# EAGLE design analog (EAGLE 8.3.0)

## Sheet 1 of 3
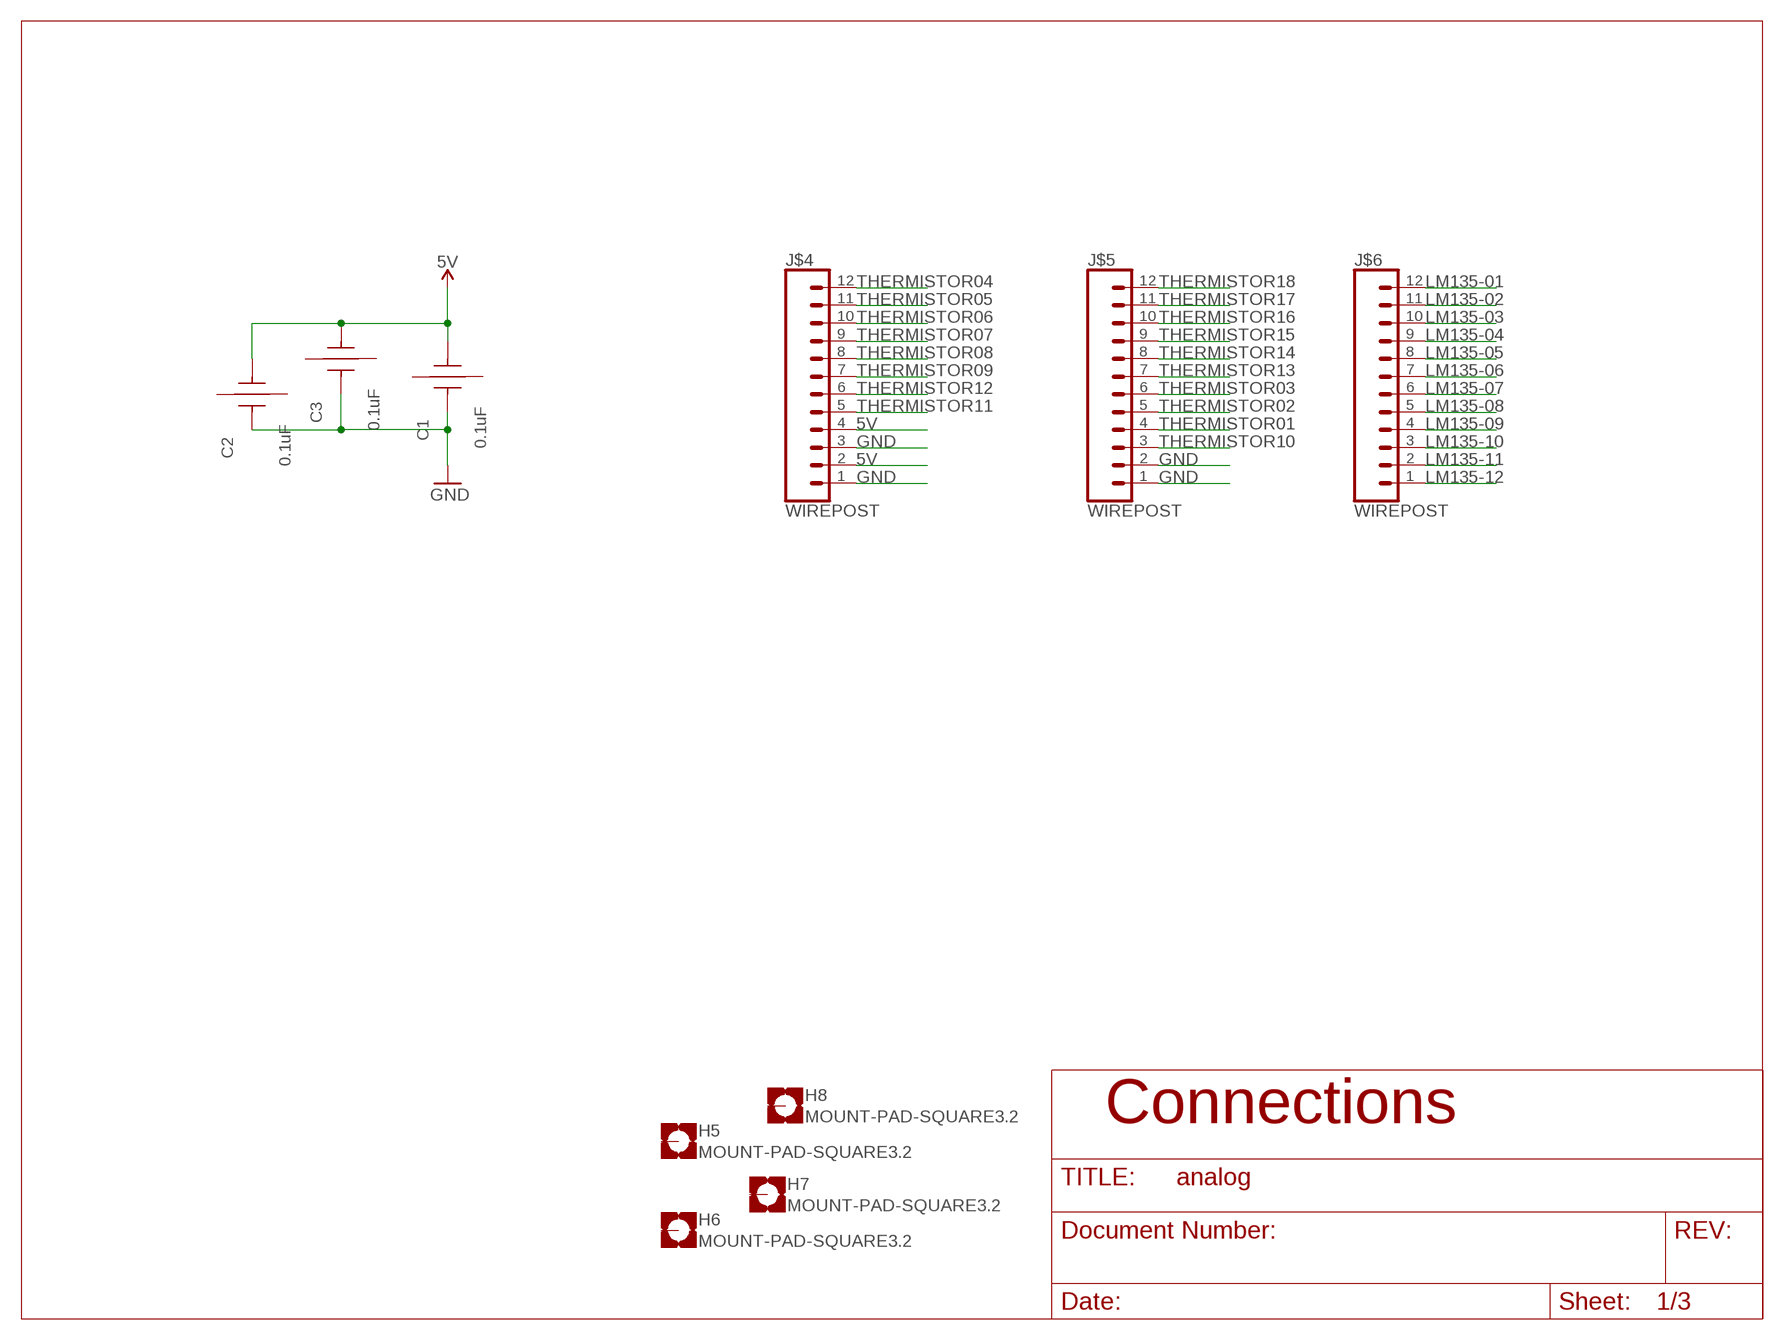
[diagram p0: schematic, sheet 1]

### Parts
C1  0.1uF  100X14W104MV4T  [X14]
C2  0.1uF  100X14W104MV4T  [X14]
C3  0.1uF  100X14W104MV4T  [X14]
H5  MOUNT-PAD-SQUARE3.2  [3,2-PAD-SQUARE]
H6  MOUNT-PAD-SQUARE3.2  [3,2-PAD-SQUARE]
H7  MOUNT-PAD-SQUARE3.2  [3,2-PAD-SQUARE]
H8  MOUNT-PAD-SQUARE3.2  [3,2-PAD-SQUARE]
J$4  WIREPOST  [WIREWRAPPOST]
J$5  WIREPOST  [WIREWRAPPOST]
J$6  WIREPOST  [WIREWRAPPOST]

### Nets
5V: C1.2 C2.2 C3.2 J$4.2 J$4.4 ; also sheet 2,3
GND [gnd]: C1.1 C2.1 C3.1 J$4.1 J$4.3 J$5.1 J$5.2 ; also sheet 2,3
LM135-01: J$6.12 ; also sheet 3
LM135-02: J$6.11 ; also sheet 3
LM135-03: J$6.10 ; also sheet 3
LM135-04: J$6.9 ; also sheet 3
LM135-05: J$6.8 ; also sheet 3
LM135-06: J$6.7 ; also sheet 3
LM135-07: J$6.6 ; also sheet 3
LM135-08: J$6.5 ; also sheet 3
LM135-09: J$6.4 ; also sheet 3
LM135-10: J$6.3 ; also sheet 3
LM135-11: J$6.2 ; also sheet 3
LM135-12: J$6.1 ; also sheet 3
THERMISTOR01: J$5.4 ; also sheet 2
THERMISTOR02: J$5.5 ; also sheet 2
THERMISTOR03: J$5.6 ; also sheet 2
THERMISTOR04: J$4.12 ; also sheet 2
THERMISTOR05: J$4.11 ; also sheet 2
THERMISTOR06: J$4.10 ; also sheet 2
THERMISTOR07: J$4.9 ; also sheet 2
THERMISTOR08: J$4.8 ; also sheet 2
THERMISTOR09: J$4.7 ; also sheet 2
THERMISTOR10: J$5.3 ; also sheet 2
THERMISTOR11: J$4.5 ; also sheet 2
THERMISTOR12: J$4.6 ; also sheet 2
THERMISTOR13: J$5.7 ; also sheet 2
THERMISTOR14: J$5.8 ; also sheet 2
THERMISTOR15: J$5.9 ; also sheet 2
THERMISTOR16: J$5.10 ; also sheet 2
THERMISTOR17: J$5.11 ; also sheet 2
THERMISTOR18 [gnd]: J$5.12 ; also sheet 2
Unconnected: C1.3 C1.4 C2.3 C2.4 C3.3 C3.4 H5.B3,2(MOUNT) H6.B3,2(MOUNT) H7.B3,2(MOUNT) H8.B3,2(MOUNT)

### Notes on the sheet
- Connections

## Sheet 2 of 3
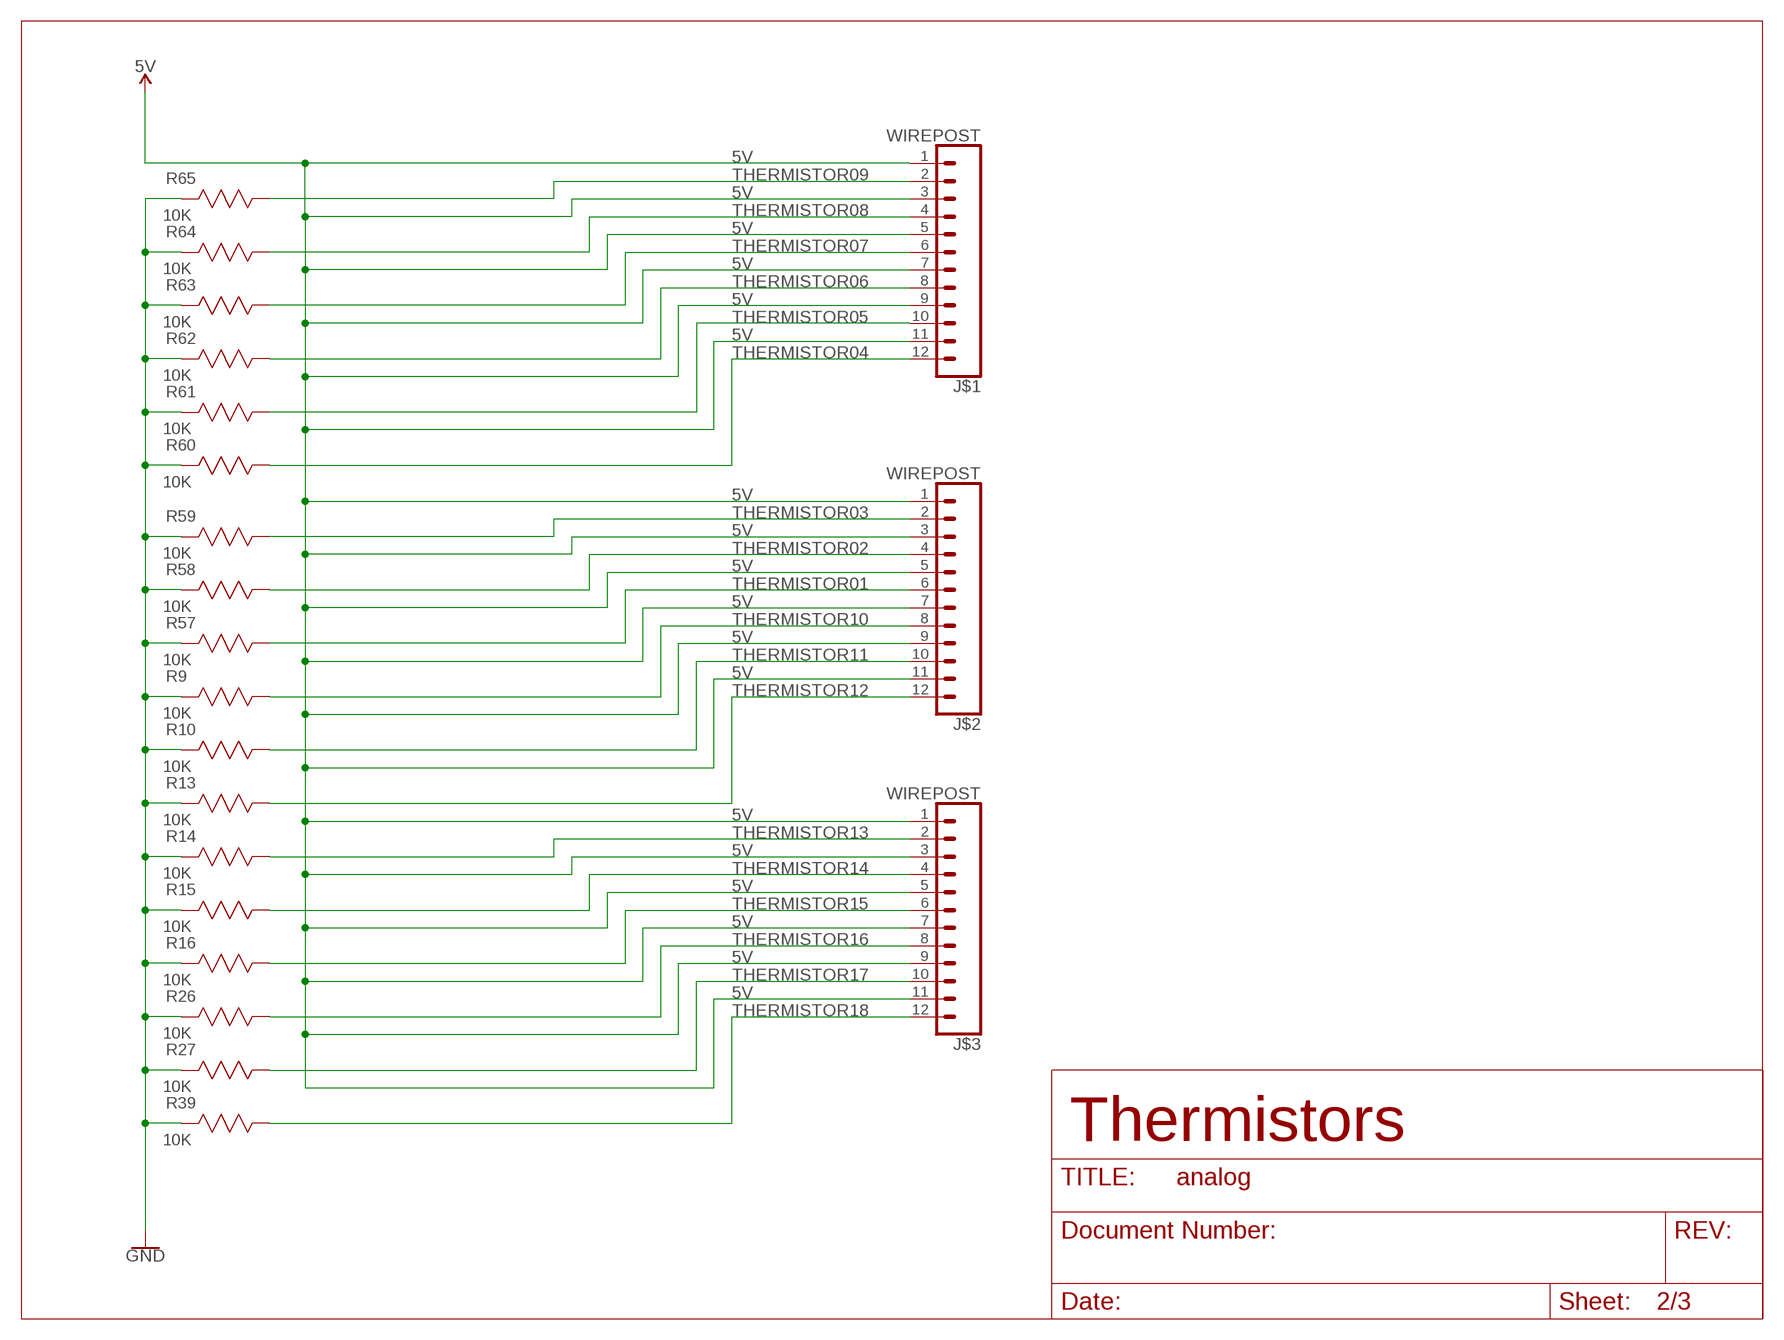
[diagram p1: schematic, sheet 2]

### Parts
J$1  WIREPOST  [WIREWRAPPOST]
J$2  WIREPOST  [WIREWRAPPOST]
J$3  WIREPOST  [WIREWRAPPOST]
R9  10K  RC0603JR-0710KL  [RC0603N]
R10  10K  RC0603JR-0710KL  [RC0603N]
R13  10K  RC0603JR-0710KL  [RC0603N]
R14  10K  RC0603JR-0710KL  [RC0603N]
R15  10K  RC0603JR-0710KL  [RC0603N]
R16  10K  RC0603JR-0710KL  [RC0603N]
R26  10K  RC0603JR-0710KL  [RC0603N]
R27  10K  RC0603JR-0710KL  [RC0603N]
R39  10K  RC0603JR-0710KL  [RC0603N]
R57  10K  RC0603JR-0710KL  [RC0603N]
R58  10K  RC0603JR-0710KL  [RC0603N]
R59  10K  RC0603JR-0710KL  [RC0603N]
R60  10K  RC0603JR-0710KL  [RC0603N]
R61  10K  RC0603JR-0710KL  [RC0603N]
R62  10K  RC0603JR-0710KL  [RC0603N]
R63  10K  RC0603JR-0710KL  [RC0603N]
R64  10K  RC0603JR-0710KL  [RC0603N]
R65  10K  RC0603JR-0710KL  [RC0603N]

### Nets
5V: J$1.1 J$1.3 J$1.5 J$1.7 J$1.9 J$1.11 J$2.1 J$2.3 J$2.5 J$2.7 J$2.9 J$2.11 J$3.1 J$3.3 J$3.5 J$3.7 J$3.9 J$3.11 ; also sheet 1,3
GND [gnd]: R9.2 R10.2 R13.2 R14.2 R15.2 R16.2 R26.2 R27.2 R39.2 R57.2 R58.2 R59.2 R60.2 R61.2 R62.2 R63.2 R64.2 R65.2 ; also sheet 1,3
THERMISTOR01: J$2.6 R57.1 ; also sheet 1
THERMISTOR02: J$2.4 R58.1 ; also sheet 1
THERMISTOR03: J$2.2 R59.1 ; also sheet 1
THERMISTOR04: J$1.12 R60.1 ; also sheet 1
THERMISTOR05: J$1.10 R61.1 ; also sheet 1
THERMISTOR06: J$1.8 R62.1 ; also sheet 1
THERMISTOR07: J$1.6 R63.1 ; also sheet 1
THERMISTOR08: J$1.4 R64.1 ; also sheet 1
THERMISTOR09: J$1.2 R65.1 ; also sheet 1
THERMISTOR10: J$2.8 R9.1 ; also sheet 1
THERMISTOR11: J$2.10 R10.1 ; also sheet 1
THERMISTOR12: J$2.12 R13.1 ; also sheet 1
THERMISTOR13: J$3.2 R14.1 ; also sheet 1
THERMISTOR14: J$3.4 R15.1 ; also sheet 1
THERMISTOR15: J$3.6 R16.1 ; also sheet 1
THERMISTOR16: J$3.8 R26.1 ; also sheet 1
THERMISTOR17: J$3.10 R27.1 ; also sheet 1
THERMISTOR18 [gnd]: J$3.12 R39.1 ; also sheet 1

### Notes on the sheet
- Thermistors

## Sheet 3 of 3
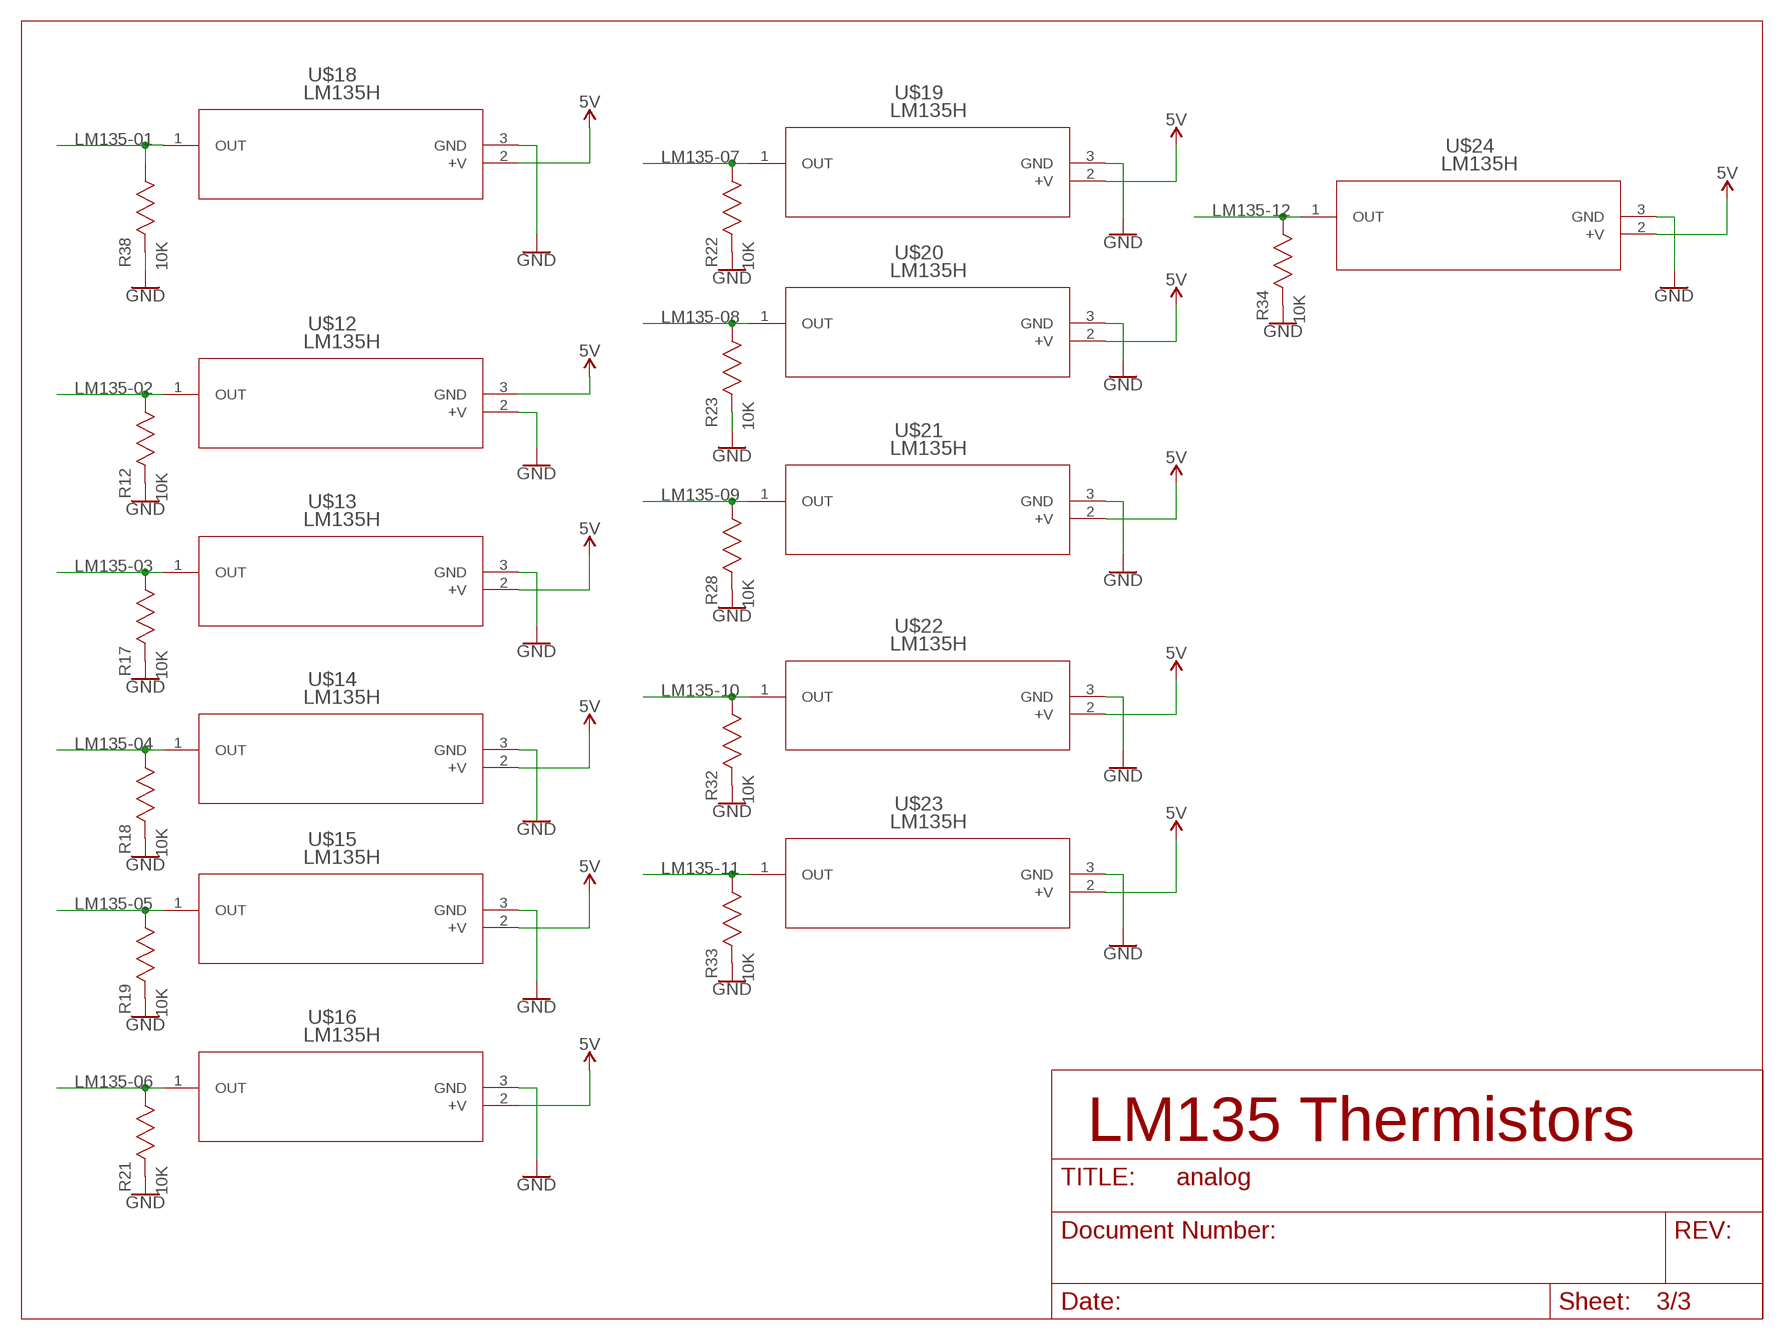
[diagram p2: schematic, sheet 3]

### Parts
R12  10K  RC0603JR-0710KL  [RC0603N]
R17  10K  RC0603JR-0710KL  [RC0603N]
R18  10K  RC0603JR-0710KL  [RC0603N]
R19  10K  RC0603JR-0710KL  [RC0603N]
R21  10K  RC0603JR-0710KL  [RC0603N]
R22  10K  RC0603JR-0710KL  [RC0603N]
R23  10K  RC0603JR-0710KL  [RC0603N]
R28  10K  RC0603JR-0710KL  [RC0603N]
R32  10K  RC0603JR-0710KL  [RC0603N]
R33  10K  RC0603JR-0710KL  [RC0603N]
R34  10K  RC0603JR-0710KL  [RC0603N]
R38  10K  RC0603JR-0710KL  [RC0603N]
U$12  LM135H  [TO46]
U$13  LM135H  [TO46]
U$14  LM135H  [TO46]
U$15  LM135H  [TO46]
U$16  LM135H  [TO46]
U$18  LM135H  [TO46]
U$19  LM135H  [TO46]
U$20  LM135H  [TO46]
U$21  LM135H  [TO46]
U$22  LM135H  [TO46]
U$23  LM135H  [TO46]
U$24  LM135H  [TO46]

### Nets
5V: U$12.3(GND) U$13.2(+V) U$14.2(+V) U$15.2(+V) U$16.2(+V) U$18.2(+V) U$19.2(+V) U$20.2(+V) U$21.2(+V) U$22.2(+V) U$23.2(+V) U$24.2(+V) ; also sheet 1,2
GND [gnd]: R12.2 R17.2 R18.2 R19.2 R21.2 R22.2 R23.2 R28.2 R32.2 R33.2 R34.2 R38.2 U$12.2(+V) U$13.3(GND) U$14.3(GND) U$15.3(GND) U$16.3(GND) U$18.3(GND) U$19.3(GND) U$20.3(GND) U$21.3(GND) U$22.3(GND) U$23.3(GND) U$24.3(GND) ; also sheet 1,2
LM135-01: R38.1 U$18.1(OUT) ; also sheet 1
LM135-02: R12.1 U$12.1(OUT) ; also sheet 1
LM135-03: R17.1 U$13.1(OUT) ; also sheet 1
LM135-04: R18.1 U$14.1(OUT) ; also sheet 1
LM135-05: R19.1 U$15.1(OUT) ; also sheet 1
LM135-06: R21.1 U$16.1(OUT) ; also sheet 1
LM135-07: R22.1 U$19.1(OUT) ; also sheet 1
LM135-08: R23.1 U$20.1(OUT) ; also sheet 1
LM135-09: R28.1 U$21.1(OUT) ; also sheet 1
LM135-10: R32.1 U$22.1(OUT) ; also sheet 1
LM135-11: R33.1 U$23.1(OUT) ; also sheet 1
LM135-12: R34.1 U$24.1(OUT) ; also sheet 1

### Notes on the sheet
- LM135 Thermistors

## Library data of the parts
C1-C3 = capacitor_01uf:100X14W104MV4T; MANUFACTURER_PART_NUMBER: 100X14W104MV4T; VENDOR: Johanson Technology
H5-H8 = holes:MOUNT-PAD-SQUARE: MOUNTING PAD, square
J$1-J$6 = cubesat:WIREPOST
R9 R10 R12-R19 R21-R23 R26-R28 R32-R34 R38 R39 R57-R65 = cubesat_r10K:RC0603JR-0710KL; MANUFACTURER_PART_NUMBER: RC0603JR0710KL; VENDOR: Yageo
U$12-U$16 U$18-U$24 = kls_cubesat:LM135H; MANUFACTURER_PART_NUMBER: LM135H; VENDOR: Linear Technology

## Net classes
1 power: width 0.61 mm, drill 0.406 mm, clearance 0.205 mm to class 0, clearance 0.205 mm
2 gnd: width 0.305 mm, drill 0.406 mm, clearance 0.205 mm to class 0, clearance 0.205 mm to class 1, clearance 0.205 mm
3 power usb: width 0.508 mm, drill 0.406 mm, clearance 0.205 mm to class 0, clearance 0.205 mm to class 1, clearance 0.205 mm to class 2, clearance 0.205 mm

## Board
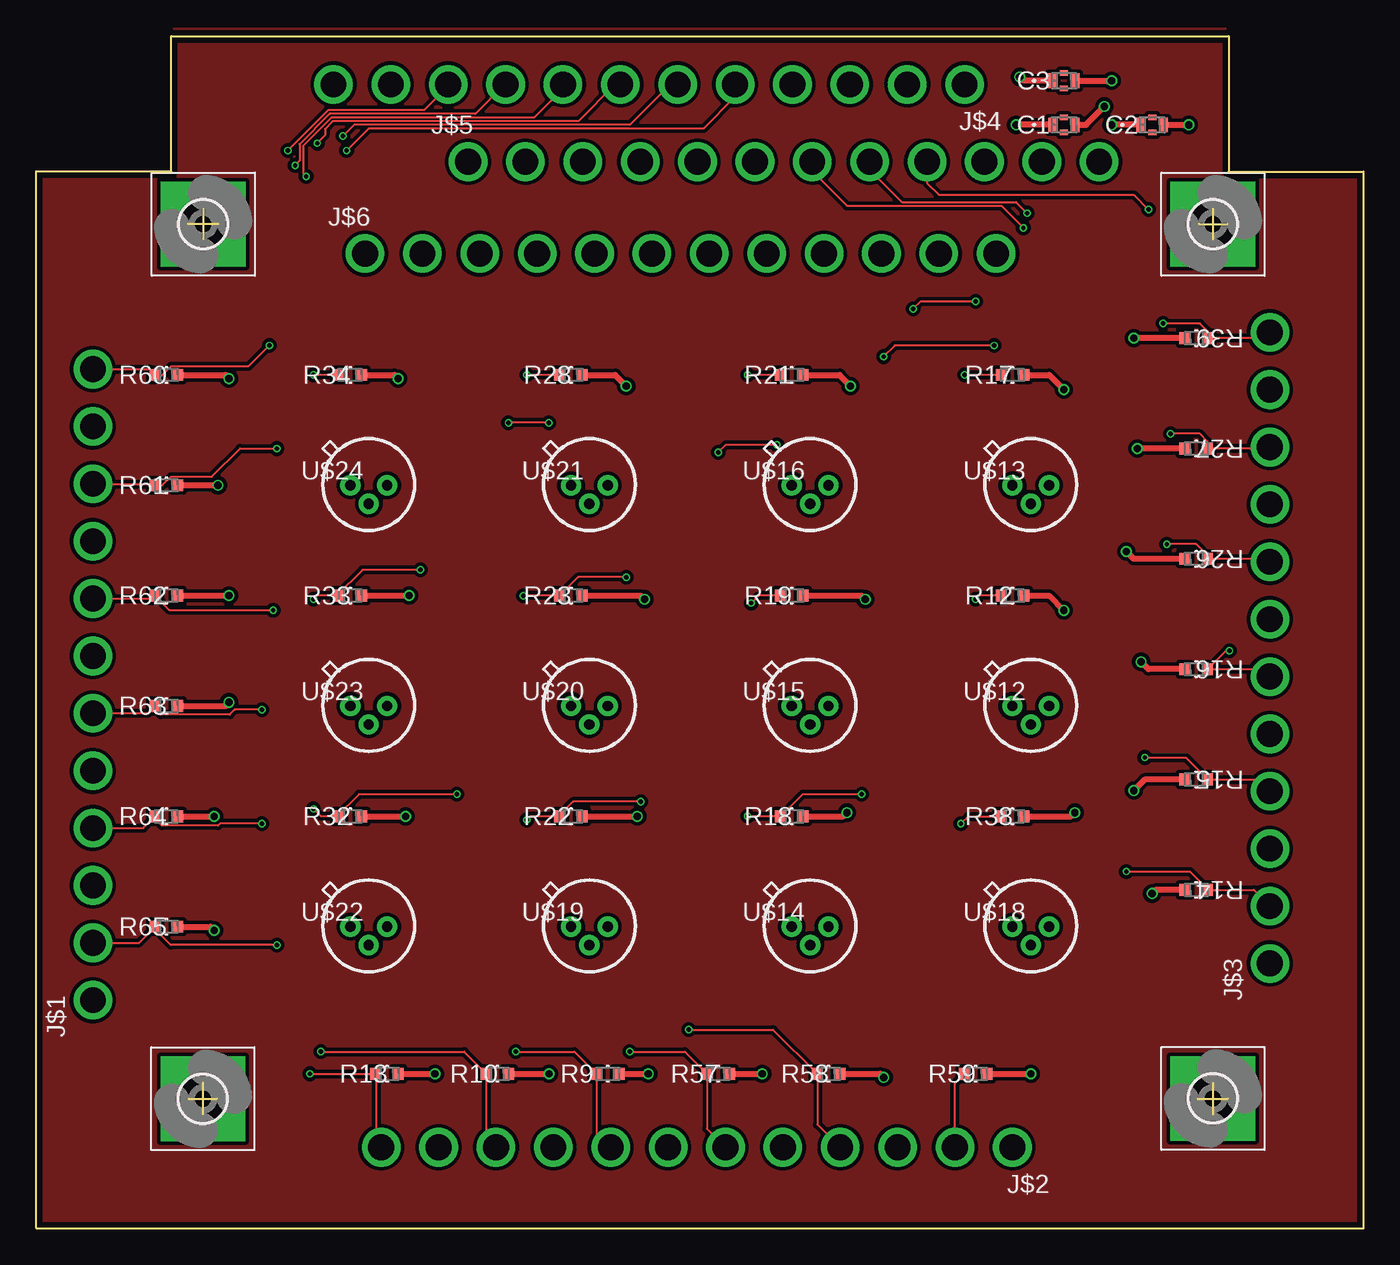
[diagram p3: board, top side]
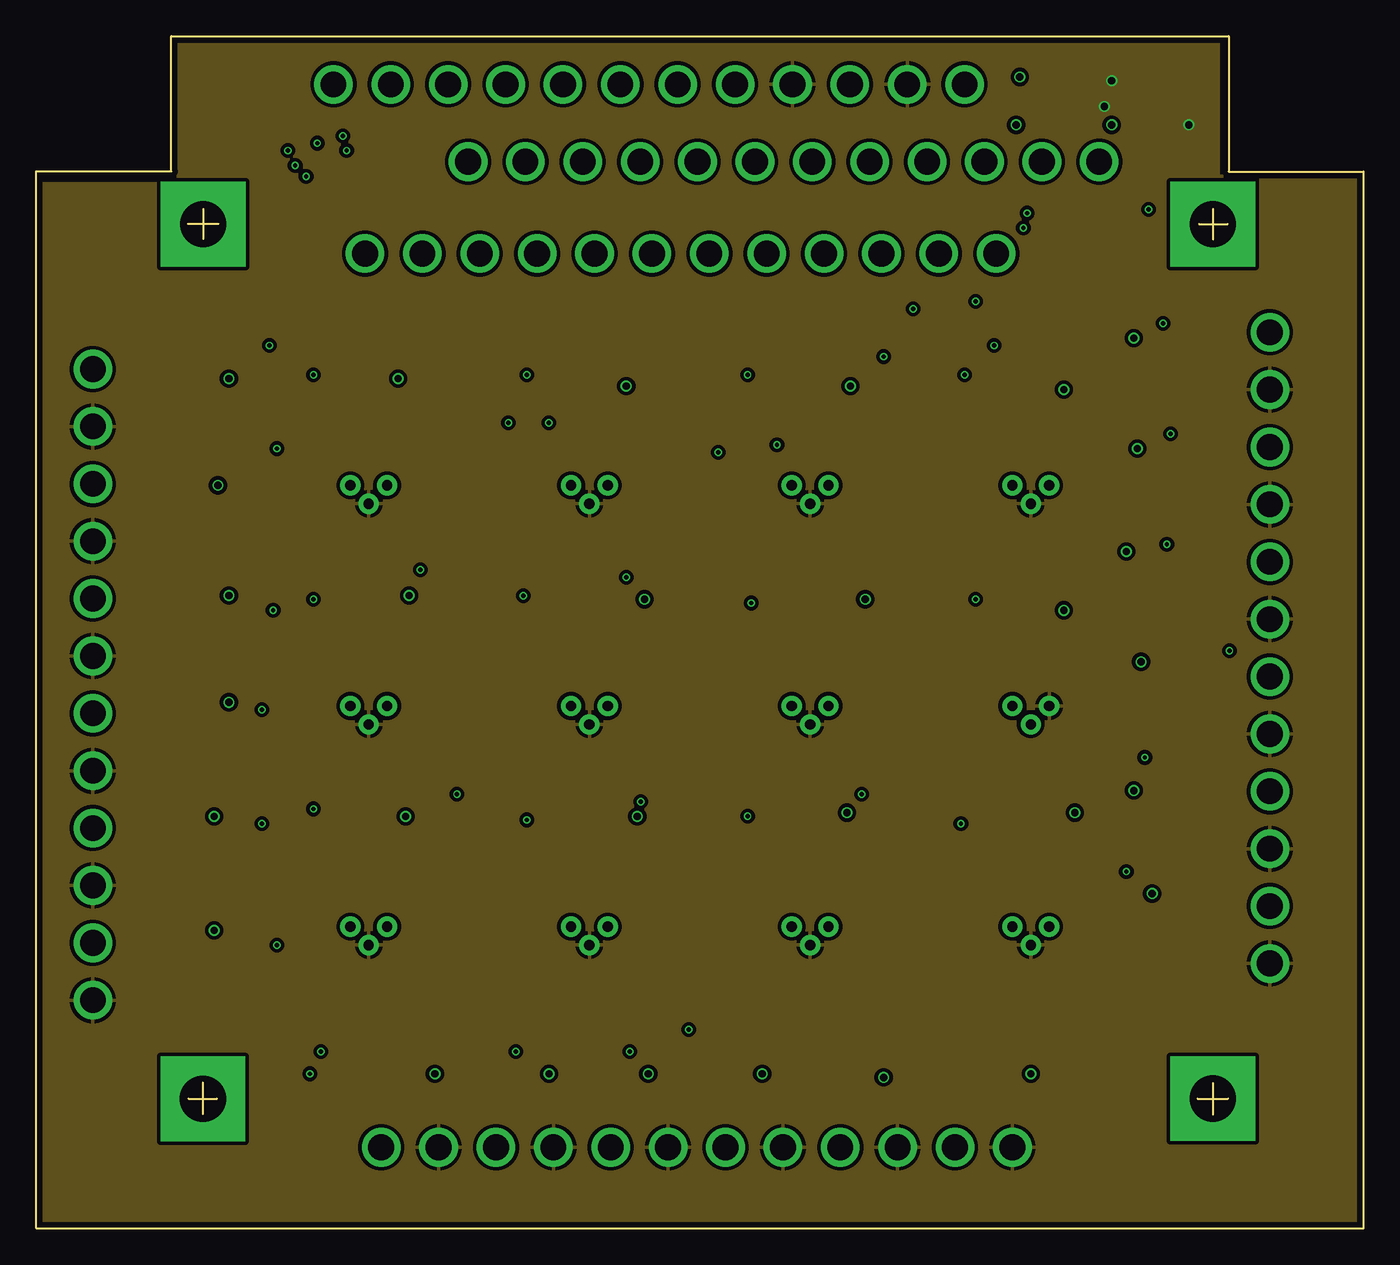
[diagram p4: board, inner layer Route2]
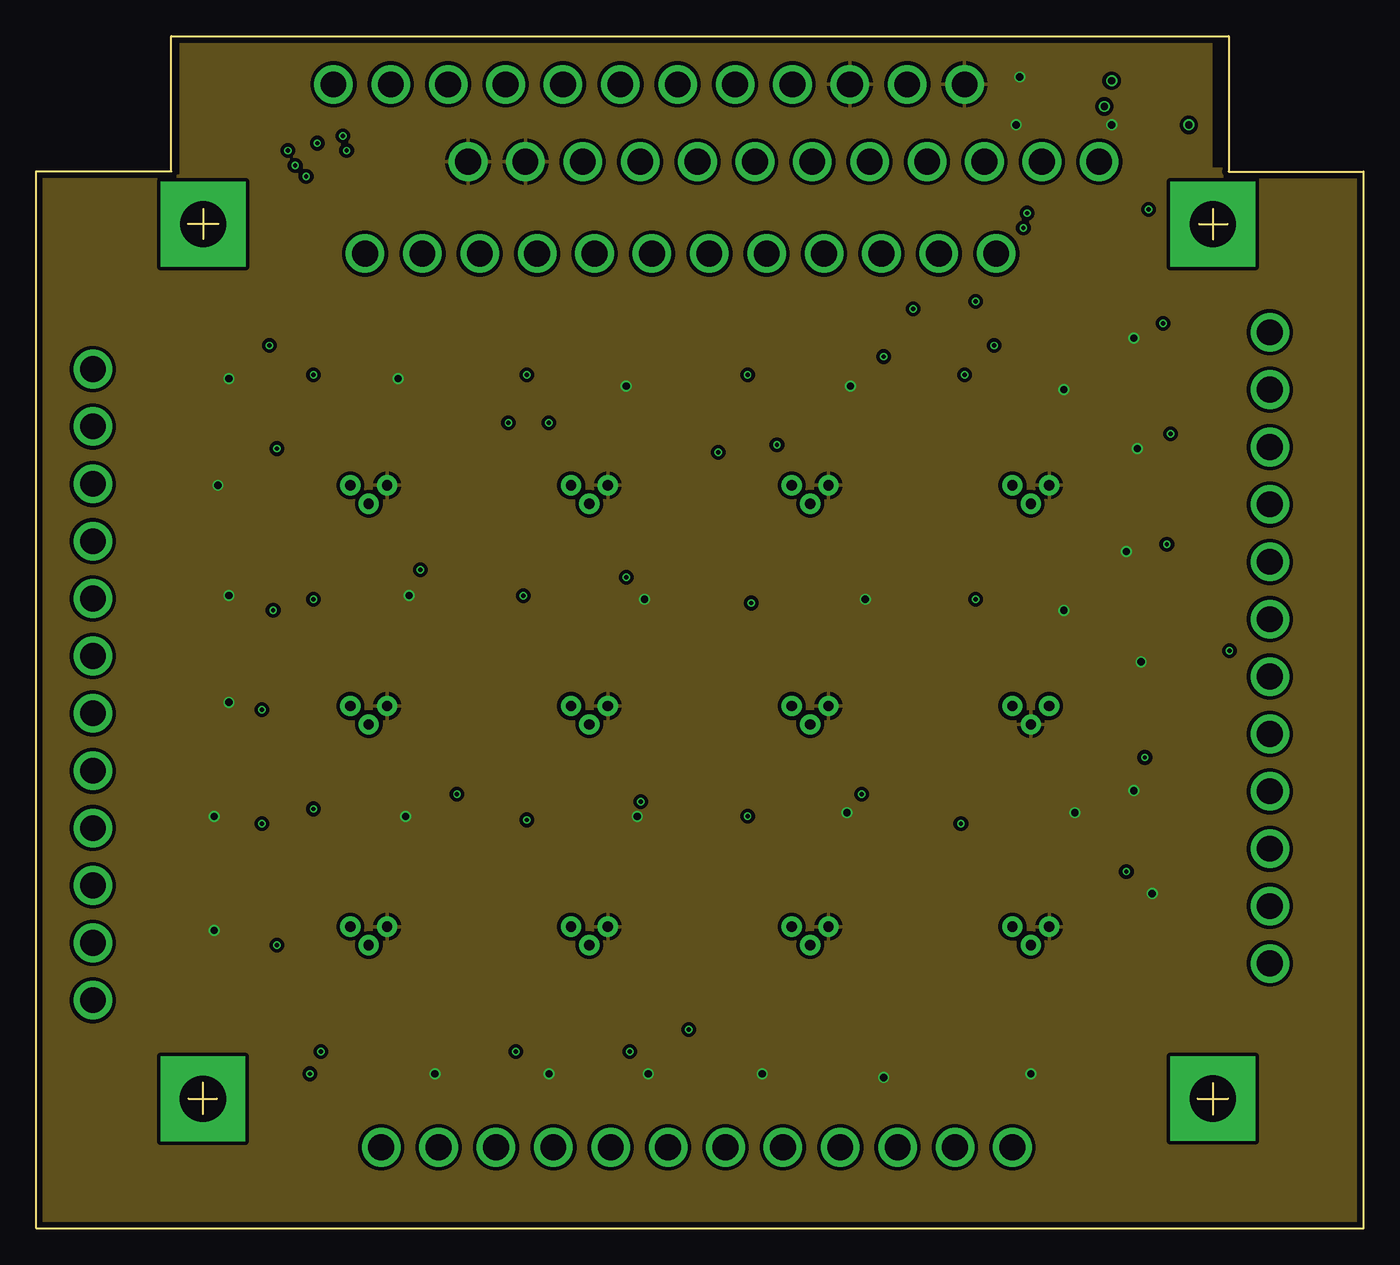
[diagram p5: board, inner layer Route15]
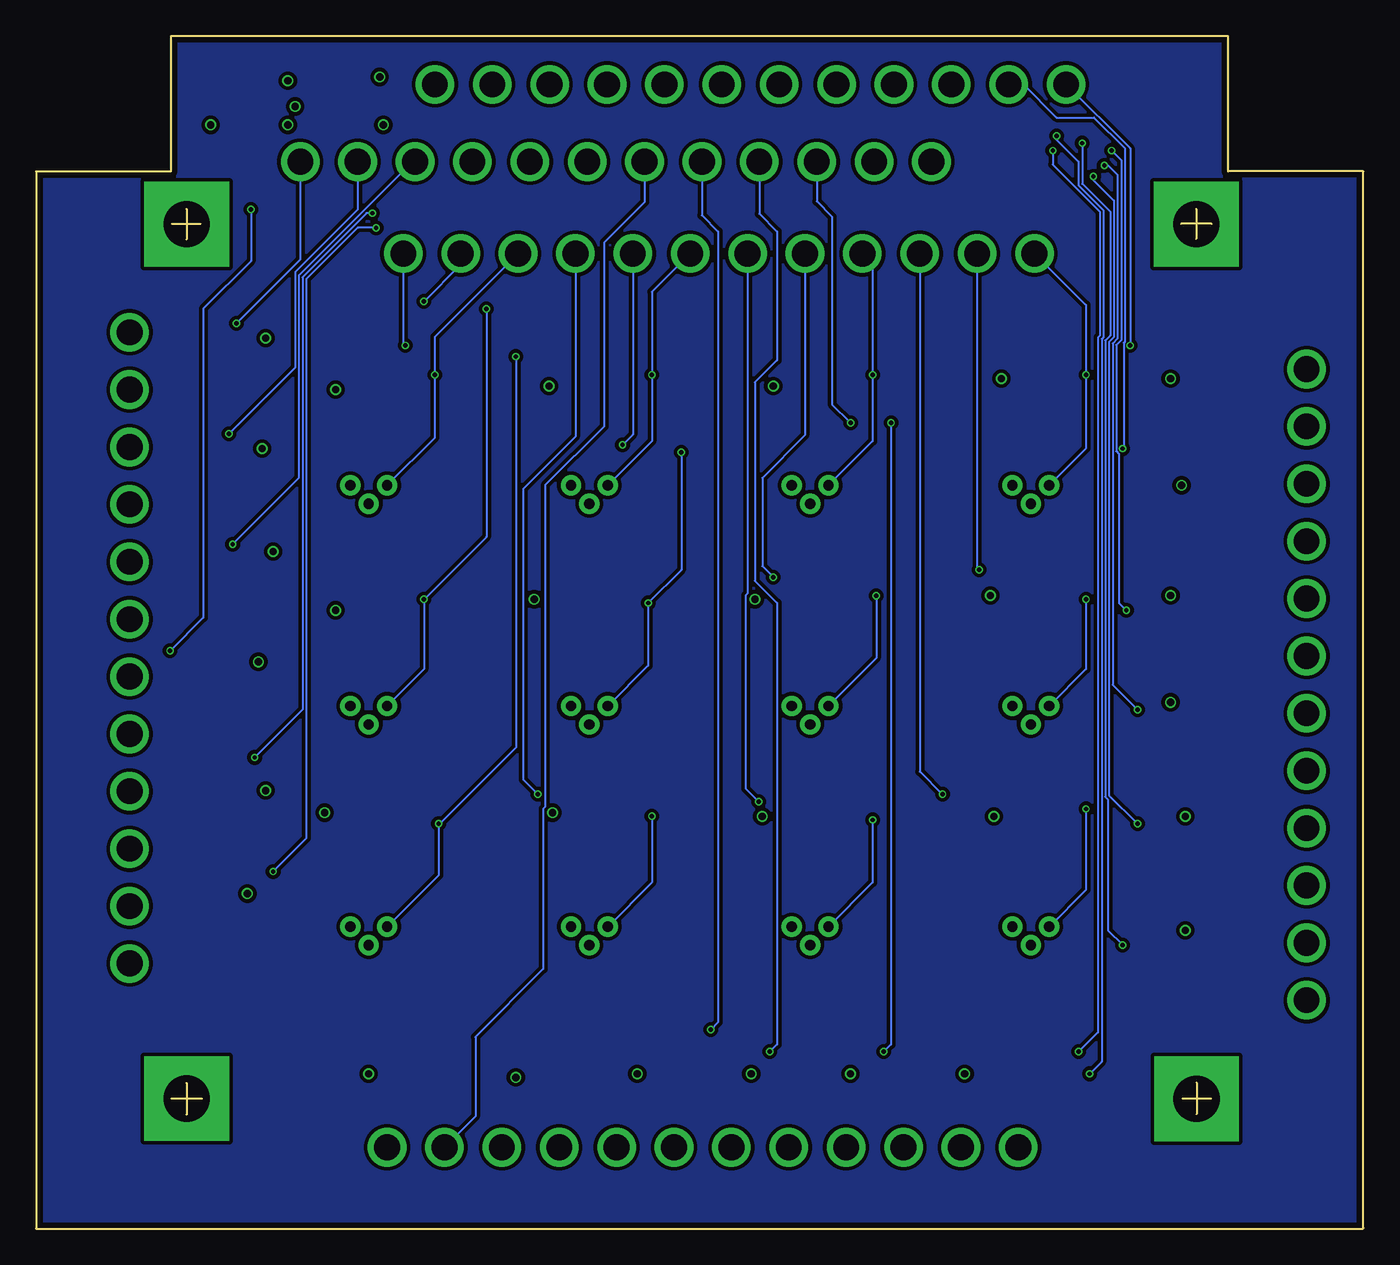
[diagram p6: board, bottom side, seen from below]

Size 91.64 x 82.35 mm. Coordinates in mm from the lower left corner, seen from the top.
Outline: 11.53,70.41 11.53,68.35
Outline: 10.49,69.39 12.6,69.39
Outline: 10.52,8.97 12.5,8.97
Outline: 11.51,10.08 11.51,7.92
Outline: 81.25,10.06 81.25,7.87
Outline: 80.19,8.97 82.3,8.97
Outline: 81.25,70.41 81.25,68.33
Outline: 80.29,69.37 82.27,69.37
Outline: 0,0.03 0,73.03 9.32,73.03 9.32,82.35 82.35,82.35 82.35,73 91.64,73 91.64,0 0.03,0 0,0.03
Copper layers (1*2*15*16): Top 0.035559375mm / dielectric 0.17018125mm / Route2 0.01778125mm / dielectric 47mil / Route15 0.01778125mm / dielectric 0.17018125mm / Bottom 0.035559375mm
Design rules "oshpark-4layer": minimum track width 5mil, minimum drill 10mil, track to track 5mil, track to pad 5mil, pad to pad 5mil, via to via 5mil, smd to smd 5mil, copper to edge 15mil, drill to drill 6mil, minimum pad ring 4mil, minimum via ring 4mil, stop-mask expansion 2.5mil, vias tented up to drill 0mil, thermal gap 10mil

### Footprints (pad centres in the part's own frame; a part is rotated, then mirrored left to right if it is on the bottom)
X14 = smd 0.61 x 1.016: 1 -0.775,0; 2 0.775,0 | smd 0.559 x 0.381: 3 0,0.521; 4 0,-0.521
3,2-PAD-SQUARE = drill 3.2 pad 5.842 square: B3,2 0,0
WIREWRAPPOST = drill 1.778 pad 2.54: 1 0,0; 2 3.962,0; 3 7.925,0; 4 11.887,0; 5 15.85,0; 6 19.812,0; 7 23.774,0; 8 27.737,0; 9 31.699,0; 10 35.662,0; 11 39.624,0; 12 43.586,0
RC0603N = smd 0.762 x 0.813: 1 -0.775,0; 2 0.775,0
TO46 = drill 0.711 pad 1.397: 1 0,0; 2 1.27,-1.27; 3 2.54,0

### Placement (x,y rotation side)
C1  70.97,76.23 0 top
C2  77.06,76.23 0 top
C3  70.97,79.27 0 top
H5  11.51,8.97 0 top
H6  81.25,8.99 0 top
H7  81.25,69.37 0 top
H8  11.53,69.37 0 top
J$1  3.91,15.77 90 top
J$2  67.41,5.61 180 top
J$3  85.19,18.31 90 top
J$4  64.11,79.02 180 top
J$5  29.82,73.69 0 top
J$6  22.71,67.34 0 top
R9  39.47,10.69 0 top
R10  31.85,10.69 0 top
R12  67.41,43.71 0 top
R13  24.23,10.69 0 top
R14  80.11,23.39 180 top
R15  80.11,31.01 180 top
R16  80.11,38.63 180 top
R17  67.41,58.95 0 top
R18  52.17,28.47 0 top
R19  52.17,43.71 0 top
R21  52.17,58.95 0 top
R22  36.93,28.47 0 top
R23  36.93,43.71 0 top
R26  80.11,46.25 180 top
R27  80.11,53.87 180 top
R28  36.93,58.95 0 top
R32  21.69,28.47 0 top
R33  21.69,43.71 0 top
R34  21.69,58.95 0 top
R38  67.41,28.47 0 top
R39  80.11,61.49 180 top
R57  47.09,10.69 0 top
R58  54.71,10.69 0 top
R59  64.87,10.69 0 top
R60  8.99,58.95 0 top
R61  8.99,51.33 0 top
R62  8.99,43.71 0 top
R63  8.99,36.09 0 top
R64  8.99,28.47 0 top
R65  8.99,20.85 0 top
U$12  67.41,36.09 0 top
U$13  67.41,51.33 0 top
U$14  52.17,20.85 0 top
U$15  52.17,36.09 0 top
U$16  52.17,51.33 0 top
U$18  67.41,20.85 0 top
U$19  36.93,20.85 0 top
U$20  36.93,36.09 0 top
U$21  36.93,51.33 0 top
U$22  21.69,20.85 0 top
U$23  21.69,36.09 0 top
U$24  21.69,51.33 0 top

### Tracks (layer width: path | path; a pad name or v marks a point on that pad's centre or on a via)
5V  (via drill 0.5)
  Top 0.406: C3.2 v74.27,79.27 | C1.2 72.49,76.23 v73.76,77.5 | C2.2 v79.6,76.23
  pour Route2 (isolate 0.254): -0.15,0.03 91.8,0.03 91.8,72.67 81.64,72.67 81.64,82.32 9.5,82.32 9.5,72.16 -0.15,72.16
GND  (via drill 0.5)
  Top 0.406: R65.2 12.04,20.85 v12.29,20.6 | R64.2 v12.29,28.47 | R32.2 v25.5,28.47 | R22.2 v41.5,28.47 | R63.2 13.06,36.09 v13.31,36.35 | R62.2 v13.31,43.71 | R60.2 13.06,58.95 v13.31,58.7 | R61.2 v12.55,51.33 | R13.2 v27.53,10.69 | R10.2 v35.41,10.69 | R9.2 v42.27,10.69 | R57.2 v50.14,10.69 | R59.2 v68.68,10.69 | R14.2 77.32,23.39 v77.06,23.14 | R15.2 76.56,31.01 v75.79,30.25 | R38.2 71.48,28.47 v71.73,28.73 | R18.2 55.73,28.47 v55.98,28.73 | R23.2 41.76,43.71 v42.01,43.46 | R19.2 57,43.71 v57.25,43.46 | R12.2 69.95,43.71 v70.97,42.7 | R26.2 75.79,46.25 v75.29,46.76 | R16.2 76.81,38.63 v76.3,39.14 | R33.2 v25.76,43.71 | R34.2 24.74,58.95 v24.99,58.7 | R28.2 39.98,58.95 v40.74,58.19 | R21.2 55.47,58.95 v56.24,58.19 | R17.2 69.95,58.95 v70.97,57.94 | R27.2 v76.05,53.87 | R39.2 v75.79,61.49 | R58.2 58.27,10.69 v58.52,10.44 | C3.1 68.17,79.27 v67.92,79.53 | C1.1 v67.67,76.23 | C2.1 v74.27,76.23
  pour Route15 (isolate 0.254): -0.15,0.03 91.8,0.03 91.8,73.18 81.13,73.18 81.13,81.81 10.01,81.81 10.01,72.67 0.36,72.67 0.36,0.53
LM135-01  (via drill 0.3)
  Top 0.127: R38.1 64.36,28.47 v63.86,27.97 | v66.14,60.99 59.28,60.99 v58.52,60.22
  Bottom 0.127: 63.86,27.89 v63.86,27.97 | 63.86,27.89 63.86,24.41 U$18.1 | J$6.12 66.29,61.14 v66.14,60.99 | v58.52,60.22 58.52,33.23 63.86,27.89
LM135-02  (via drill 0.3)
  Top 0.127: R12.1 65.13,43.71 v64.87,43.46 | v64.87,64.03 61.06,64.03 v60.55,63.53
  Bottom 0.127: v64.87,43.45 v64.87,43.46 | v64.87,43.45 64.87,38.63 U$12.1 | J$6.11 62.33,66.57 v64.87,64.03 | v60.55,63.53 60.55,47.77 v64.87,43.45
LM135-03  (via drill 0.3)
  Top 0.127: R17.1 v64.11,58.95
  Bottom 0.127: U$13.1 64.11,54.64 v64.11,58.95 64.11,61.6 J$6.10
LM135-04  (via drill 0.3)
  Top 0.127: v49.12,28.47 R18.1 52.92,30 v57,30
  Bottom 0.127: v49.12,28.47 49.12,23.9 U$14.1 | J$6.9 54.41,54.69 58.01,51.08 58.01,31.01 v57,30
LM135-05  (via drill 0.3)
  Top 0.127: R19.1 49.89,43.71 v49.38,43.21 | v51.16,54.13 47.6,54.13 v47.09,53.62
  Bottom 0.127: U$15.1 49.38,38.89 v49.38,43.21 47.09,45.49 v47.09,53.62 | J$6.8 50.44,54.84 v51.16,54.13
LM135-06  (via drill 0.3)
  Top 0.127: R21.1 v49.12,58.95
  Bottom 0.127: J$6.7 49.12,64.69 v49.12,58.95 49.12,54.38 U$16.1
LM135-07  (via drill 0.3)
  Top 0.127: 36.06,28.47 R22.1 | 36.06,28.47 34.14,28.47 v33.88,28.22 | v41.76,29.49 37.08,29.49 36.06,28.47
  Bottom 0.127: v33.88,28.22 33.88,23.9 U$19.1 | J$6.6 42.52,43.86 42.66,43.73 42.66,30.39 v41.76,29.49
LM135-08  (via drill 0.3)
  Top 0.127: v33.63,43.71 R23.1 37.43,44.98 v40.74,44.98
  Bottom 0.127: v33.63,43.71 33.63,39.4 U$20.1 | J$6.5 38.56,54.79 41.5,51.84 41.5,45.75 v40.74,44.98
LM135-09  (via drill 0.3)
  Top 0.127: R28.1 v33.88,58.95
  Bottom 0.127: J$6.4 33.88,66.62 v33.88,58.95 33.88,54.38 U$21.1
LM135-10  (via drill 0.3)
  Top 0.127: 20.76,28.47 R32.1 | 20.76,28.47 19.66,28.47 v19.15,28.98 | v29.06,30 22.29,30 20.76,28.47
  Bottom 0.127: v19.15,28.98 19.15,23.39 U$22.1 | J$6.3 30.63,31.57 v29.06,30
LM135-11  (via drill 0.3)
  Top 0.127: 20.75,43.71 R33.1 | 20.75,43.71 19.41,43.71 v19.15,43.46 | v26.52,45.49 22.53,45.49 20.75,43.71
  Bottom 0.127: v19.15,43.46 19.15,38.63 U$23.1 | J$6.2 26.67,45.64 v26.52,45.49
LM135-12  (via drill 0.3)
  Top 0.127: R34.1 v19.15,58.95
  Bottom 0.127: J$6.1 19.15,63.78 v19.15,58.95 19.15,53.87 U$24.1
N$1
  pour Top (isolate 0.254): -0.15,0.03 91.8,0.03 91.8,73.18 82.14,73.18 82.14,82.83 9.5,82.83 9.5,72.67 -0.15,72.67
N$2
  pour Bottom (isolate 0.254): -0.15,0.03 91.8,0.03 91.8,73.18 82.14,73.18 82.14,82.32 9.5,82.32 9.5,72.67 -0.15,72.67
THERMISTOR01  (via drill 0.3)
  Top 0.127: J$2.6 46.32,6.9 R57.1 44.79,12.22 v41,12.22
  Bottom 0.127: J$5.4 41.71,70.08 40.49,68.86 40.49,59.97 42.01,58.45 42.01,44.73 40.49,43.21 40.49,12.73 v41,12.22
THERMISTOR02  (via drill 0.3)
  Top 0.127: J$2.4 53.94,7.2 R58.1 50.89,13.74 v45.06,13.74
  Bottom 0.127: J$5.5 45.67,69.98 44.55,68.86 44.55,14.25 v45.06,13.74
THERMISTOR03
  Top 0.127: J$2.2 63.45,10.05 R59.1
  Bottom 0.127: J$5.6 49.63,70.89 52.43,68.1 52.43,55.4 56.49,51.33 56.49,29.13 56.63,28.99 56.63,17.92 61.32,13.23 61.32,7.75 J$2.2
THERMISTOR04  (via drill 0.3)
  Top 0.127: J$1.12 7.81,59.36 R60.1 8.71,58.95 9.31,59.55 14.67,59.55 v16.1,60.99
  Bottom 0.127: J$4.12 16.1,74.6 v16.1,60.99
THERMISTOR05  (via drill 0.3)
  Top 0.127: J$1.10 8.12,51.44 R61.1 8.71,51.33 9.31,51.93 12.13,51.93 14.07,53.87 v16.61,53.87
  Bottom 0.127: J$4.11 23.47,79.02 21.18,76.73 18.6,76.73 16.46,74.6 16.46,61.25 16.55,61.17 16.55,53.94 v16.61,53.87
THERMISTOR06  (via drill 0.3)
  Top 0.127: J$1.8 8.01,43.51 R62.1 9.23,42.7 v16.36,42.7 | J$4.10 28.45,78.92 26.77,77.24 20.17,77.24 v17.37,74.45
  Bottom 0.127: v17.37,74.45 16.71,73.79 16.71,61.36 17.05,61.02 17.05,53.69 16.87,53.5 16.87,43.21 v16.36,42.7
THERMISTOR07  (via drill 0.3)
  Top 0.127: J$1.6 7.71,35.59 8.1,35.97 | 8.1,35.97 R63.1 | J$4.9 32.36,79.02 30.33,76.99 20.27,76.99 18.19,74.9 18.19,73.74 v17.88,73.43 | v15.6,35.84 13.71,35.84 13.37,35.5 8.57,35.5 8.1,35.97
  Bottom 0.127: v17.88,73.43 17.63,73.43 16.97,72.77 16.97,61.46 17.31,61.13 17.31,37.55 v15.6,35.84
THERMISTOR08  (via drill 0.3)
  Top 0.127: J$1.4 7.4,27.66 8.13,28.38 | 8.13,28.38 R64.1 | J$4.8 36.37,78.71 34.39,76.73 20.38,76.73 18.44,74.8 18.44,72.87 v18.64,72.67 | v15.6,27.97 12.7,27.97 12.56,27.83 8.68,27.83 8.13,28.38
  Bottom 0.127: v18.64,72.67 18.64,72.42 17.22,70.99 17.22,61.57 17.56,61.23 17.56,29.93 v15.6,27.97
THERMISTOR09  (via drill 0.3)
  Top 0.127: J$1.2 7.1,19.74 8.12,20.76 | 8.12,20.76 R65.1 | J$4.7 39.98,79.02 37.44,76.48 20.48,76.48 19.94,75.94 19.94,75.49 v19.41,74.96 | v16.61,19.58 9.29,19.58 8.12,20.76
  Bottom 0.127: v19.41,74.96 19.41,72.16 17.48,70.23 17.48,61.67 17.82,61.34 17.82,29.83 17.63,29.64 17.63,20.6 v16.61,19.58
THERMISTOR10  (via drill 0.3)
  Top 0.127: J$2.8 38.96,5.61 38.7,5.88 R9.1 37.17,12.22 v33.12,12.22 | v35.41,55.65 v32.61,55.65
  Bottom 0.127: J$5.3 37.74,70.94 36.68,69.88 36.68,56.92 v35.41,55.65 | v32.61,55.65 32.61,12.73 v33.12,12.22
THERMISTOR11  (via drill 0.3)
  Top 0.127: J$2.10 31.08,6.29 R10.1 29.55,12.22 v19.66,12.22 | J$4.5 48.26,78.16 46.08,75.97 22.96,75.97 v21.44,74.45
  Bottom 0.127: v21.44,74.45 21.44,73.48 18.19,70.23 18.19,61.68 18.32,61.55 18.32,13.55 v19.66,12.22
THERMISTOR12  (via drill 0.3)
  Top 0.127: 23.46,10.61 R13.1 | 23.46,10.61 23.46,5.98 J$2.12 | J$4.6 43.79,79.02 41,76.23 21.95,76.23 v21.18,75.46 | v18.9,10.69 23.37,10.69 23.46,10.61
  Bottom 0.127: v21.18,75.46 21.18,75.21 19.66,73.69 19.66,72.06 17.93,70.33 17.93,61.58 18.07,61.44 18.07,11.52 v18.9,10.69
THERMISTOR13  (via drill 0.3)
  Top 0.127: 80.95,23.39 R14.1 | 80.95,23.39 84.07,23.39 J$3.2 | J$5.7 53.59,73.03 55.98,70.64 66.65,70.64 v68.17,69.11 | v75.29,24.66 79.68,24.66 80.95,23.39
  Bottom 0.127: v68.17,69.11 69.44,69.11 73,65.56 73,26.95 v75.29,24.66
THERMISTOR14  (via drill 0.3)
  Top 0.127: 80.91,31.01 R15.1 | 80.91,31.01 84.38,31.01 J$3.4 | J$5.8 57.56,73.13 59.79,70.89 67.67,70.89 v68.43,70.13 | v76.56,32.54 79.38,32.54 80.91,31.01
  Bottom 0.127: v68.43,70.13 68.83,70.13 73.25,65.71 73.25,35.84 v76.56,32.54
THERMISTOR15  (via drill 0.3)
  Top 0.127: 80.9,38.63 R16.1 | 80.9,38.63 84.68,38.63 J$3.6 | J$5.9 61.52,72.21 62.33,71.4 75.79,71.4 v76.81,70.38 | v82.4,39.9 82.17,39.9 80.9,38.63
  Bottom 0.127: v76.81,70.38 76.81,66.83 80.11,63.53 80.11,42.19 v82.4,39.9
THERMISTOR16  (via drill 0.3)
  Top 0.127: J$3.8 84.99,46.25 R26.1 80.89,46.49 80.11,47.27 v78.08,47.27
  Bottom 0.127: J$5.10 65.63,73.69 73.51,65.81 73.51,51.84 v78.08,47.27
THERMISTOR17  (via drill 0.3)
  Top 0.127: J$3.10 85.7,53.47 85.7,53.37 85.19,53.87 R27.1 80.89,54.37 80.37,54.89 v78.33,54.89
  Bottom 0.127: J$5.11 69.44,70.38 73.76,66.07 73.76,59.46 v78.33,54.89
THERMISTOR18  (via drill 0.3)
  Top 0.127: J$3.12 85.04,61.75 84.68,61.75 84.43,61.49 R39.1 80.89,61.99 80.37,62.51 v77.83,62.51
  Bottom 0.127: J$5.12 73.41,66.93 v77.83,62.51